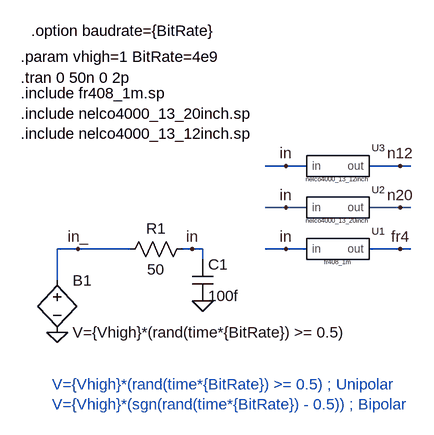
[diagram p0: schematic Channel_model_TRAN.asc]
Channel_model_TRAN.asc, the LTspice schematic file:
Version 4.1
SHEET 1 880 680
WIRE 272 -64 240 -64
WIRE 304 -64 272 -64
WIRE 448 -64 400 -64
WIRE 464 -64 448 -64
WIRE 272 0 240 0
WIRE 304 0 272 0
WIRE 448 0 400 0
WIRE 464 0 448 0
WIRE -48 64 -80 64
WIRE 32 64 -48 64
WIRE 128 64 112 64
WIRE 144 64 128 64
WIRE 272 64 240 64
WIRE 304 64 272 64
WIRE 448 64 400 64
WIRE 464 64 448 64
WIRE 144 80 144 64
WIRE -80 112 -80 64
FLAG -80 192 0
FLAG -48 64 in_
FLAG 448 64 fr4
FLAG 272 64 in
FLAG 448 0 n20
FLAG 272 0 in
FLAG 448 -64 n12
FLAG 272 -64 in
FLAG 144 144 0
FLAG 128 64 in
SYMBOL channel 352 64 R0
SYMATTR SpiceModel fr408_1m
SYMATTR InstName U1
SYMBOL channel 352 0 R0
SYMATTR SpiceModel nelco4000_13_20inch
SYMATTR InstName U2
SYMBOL channel 352 -64 R0
SYMATTR SpiceModel nelco4000_13_12inch
SYMATTR InstName U3
SYMBOL bv -80 96 R0
SYMATTR InstName B1
SYMATTR Value V={Vhigh}*(rand(time*{BitRate}) >= 0.5)
SYMBOL res 128 48 R90
WINDOW 0 0 56 VBottom 2
WINDOW 3 32 56 VTop 2
SYMATTR InstName R1
SYMATTR Value 50
SYMBOL cap 128 80 R0
SYMATTR InstName C1
SYMATTR Value 100f
TEXT -136 -176 Left 2 !.include fr408_1m.sp\n.include nelco4000_13_20inch.sp\n.include nelco4000_13_12inch.sp
TEXT -136 -232 Left 2 !.param vhigh=1 BitRate=4e9
TEXT -136 -200 Left 2 !.tran 0 50n 0 2p
TEXT -88 272 Left 2 ;V={Vhigh}*(rand(time*{BitRate}) >= 0.5) ; Unipolar\nV={Vhigh}*(sgn(rand(time*{BitRate}) - 0.5)) ; Bipolar
TEXT -120 -272 Left 2 !.option baudrate={BitRate}

The netlist it stands for:
* Channel_model_TRAN.asc
X§U1 in fr4 fr408_1m  ; pins in out
X§U2 in n20 nelco4000_13_20inch  ; pins in out
X§U3 in n12 nelco4000_13_12inch  ; pins in out
B1 in_ 0 V={Vhigh}*(rand(time*{BitRate}) >= 0.5)
R1 in in_ 50
C1 in 0 100f
.include fr408_1m.sp
.include nelco4000_13_20inch.sp
.include nelco4000_13_12inch.sp
.param vhigh=1 BitRate=4e9
.tran 0 50n 0 2p
* V={Vhigh}*(rand(time*{BitRate}) >= 0.5) ; Unipolar
* V={Vhigh}*(sgn(rand(time*{BitRate}) - 0.5)) ; Bipolar
.option baudrate={BitRate}
.backanno
.end

* Results of the author's LTspice run, read from the files saved beside the schematic
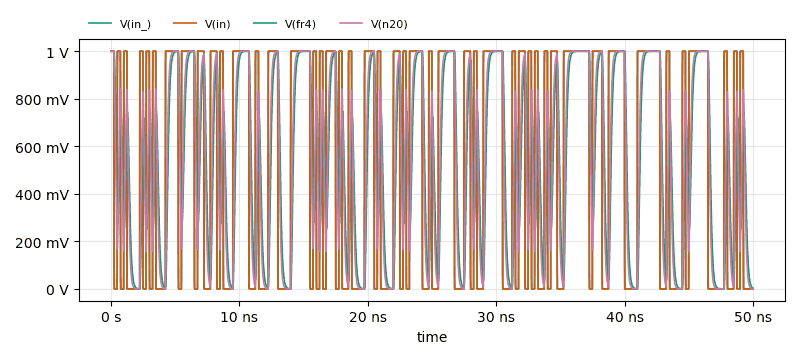
[diagram p1: Transient Analysis of Channel_model_TRAN.asc, plotted from the saved traces]
* Transient Analysis, 1 run:
*   V(in_): min 0 V, max 1 V, average 544.7 mV, rms 738.1 mV, last 1 V
*   V(in): min 0 V, max 1 V, average 544.8 mV, rms 735.1 mV, last 9.219 mV
*   V(fr4): min 11.3 µV, max 1 V, average 549.1 mV, rms 659.1 mV, last 2.78 mV
*   V(n20): min 378.3 nV, max 1 V, average 547.8 mV, rms 670.6 mV, last 473.7 µV